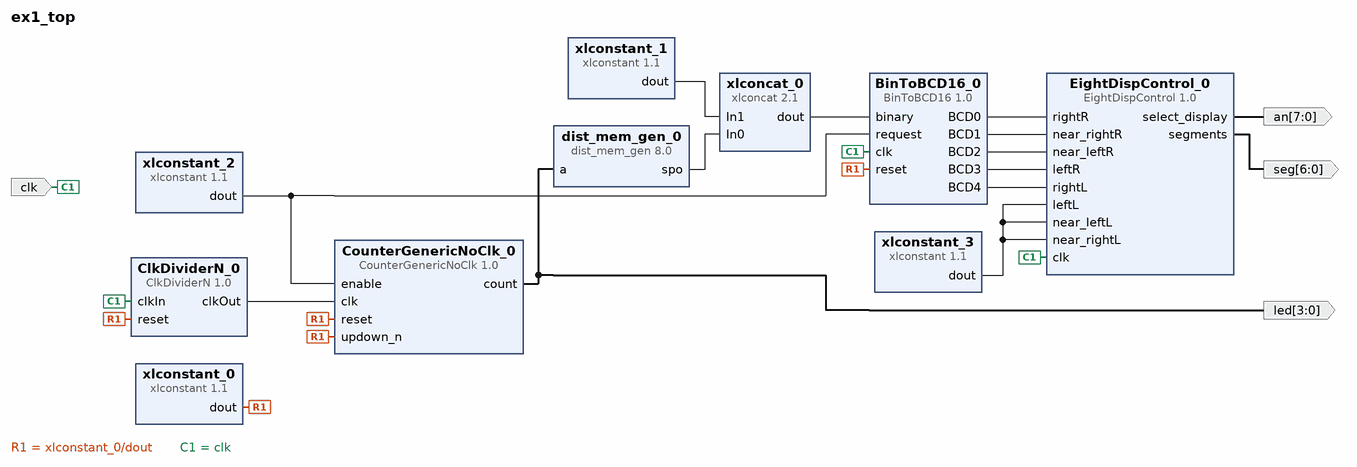
[diagram p0: block diagram of the top level]
# Vivado block design ex1_top, xc7a100tcsg324-3, Vivado 2016.4
create_bd_design ex1_top

create_bd_port -dir I clk
create_bd_port -dir O -from 3 -to 0 led
create_bd_port -dir O -from 7 -to 0 an
create_bd_port -dir O -from 6 -to 0 seg

create_bd_cell -type ip -vlnv xilinx.com:user:CounterGenericNoClk:1.0 CounterGenericNoClk_0
create_bd_cell -type ip -vlnv xilinx.com:user:ClkDividerN:1.0 ClkDividerN_0
set_property -dict {CONFIG.divFactor 100000000} [get_bd_cells ClkDividerN_0]
create_bd_cell -type ip -vlnv xilinx.com:ip:xlconstant:1.1 xlconstant_0
set_property -dict {CONFIG.CONST_VAL 0} [get_bd_cells xlconstant_0]
create_bd_cell -type ip -vlnv xilinx.com:ip:xlconcat:2.1 xlconcat_0
set_property -dict {CONFIG.IN0_WIDTH 8 CONFIG.IN1_WIDTH 8} [get_bd_cells xlconcat_0]
create_bd_cell -type ip -vlnv xilinx.com:ip:xlconstant:1.1 xlconstant_1
set_property -dict {CONFIG.CONST_WIDTH 8 CONFIG.CONST_VAL 0} [get_bd_cells xlconstant_1]
create_bd_cell -type ip -vlnv ua.pt:user:BinToBCD16:1.0 BinToBCD16_0
create_bd_cell -type ip -vlnv xilinx.com:ip:xlconstant:1.1 xlconstant_2
create_bd_cell -type ip -vlnv ua.pt:user:EightDispControl:1.0 EightDispControl_0
create_bd_cell -type ip -vlnv xilinx.com:ip:xlconstant:1.1 xlconstant_3
set_property -dict {CONFIG.CONST_WIDTH 4 CONFIG.CONST_VAL 0} [get_bd_cells xlconstant_3]
create_bd_cell -type ip -vlnv xilinx.com:ip:dist_mem_gen:8.0 dist_mem_gen_0
set_property -dict [list \
  CONFIG.depth 16 \
  CONFIG.data_width 8 \
  CONFIG.memory_type rom \
  CONFIG.coefficient_file ../../../../../../../ex1/vector16_8bits_random.coe \
  CONFIG.default_data_radix 10 \
] [get_bd_cells dist_mem_gen_0]

# ---- connections ----

connect_bd_net [get_bd_pins CounterGenericNoClk_0/count] [get_bd_ports led] [get_bd_pins dist_mem_gen_0/a]
connect_bd_net [get_bd_pins xlconstant_0/dout] \
  [get_bd_pins CounterGenericNoClk_0/reset] [get_bd_pins BinToBCD16_0/reset] [get_bd_pins ClkDividerN_0/reset] \
  [get_bd_pins CounterGenericNoClk_0/updown_n]
connect_bd_net [get_bd_ports clk] [get_bd_pins ClkDividerN_0/clkIn] [get_bd_pins BinToBCD16_0/clk] [get_bd_pins EightDispControl_0/clk]
connect_bd_net [get_bd_pins xlconstant_1/dout] [get_bd_pins xlconcat_0/In1]
connect_bd_net [get_bd_pins xlconcat_0/dout] [get_bd_pins BinToBCD16_0/binary]
connect_bd_net [get_bd_pins xlconstant_2/dout] [get_bd_pins BinToBCD16_0/request] [get_bd_pins CounterGenericNoClk_0/enable]
connect_bd_net [get_bd_pins BinToBCD16_0/BCD0] [get_bd_pins EightDispControl_0/rightR]
connect_bd_net [get_bd_pins BinToBCD16_0/BCD1] [get_bd_pins EightDispControl_0/near_rightR]
connect_bd_net [get_bd_pins BinToBCD16_0/BCD2] [get_bd_pins EightDispControl_0/near_leftR]
connect_bd_net [get_bd_pins BinToBCD16_0/BCD3] [get_bd_pins EightDispControl_0/leftR]
connect_bd_net [get_bd_pins BinToBCD16_0/BCD4] [get_bd_pins EightDispControl_0/rightL]
connect_bd_net [get_bd_pins xlconstant_3/dout] \
  [get_bd_pins EightDispControl_0/near_rightL] [get_bd_pins EightDispControl_0/near_leftL] \
  [get_bd_pins EightDispControl_0/leftL]
connect_bd_net [get_bd_pins EightDispControl_0/select_display] [get_bd_ports an]
connect_bd_net [get_bd_pins EightDispControl_0/segments] [get_bd_ports seg]
connect_bd_net [get_bd_pins ClkDividerN_0/clkOut] [get_bd_pins CounterGenericNoClk_0/clk]
connect_bd_net [get_bd_pins dist_mem_gen_0/spo] [get_bd_pins xlconcat_0/In0]

validate_bd_design
save_bd_design
